# Altium project MI_04-08_MCU.PrjPcb
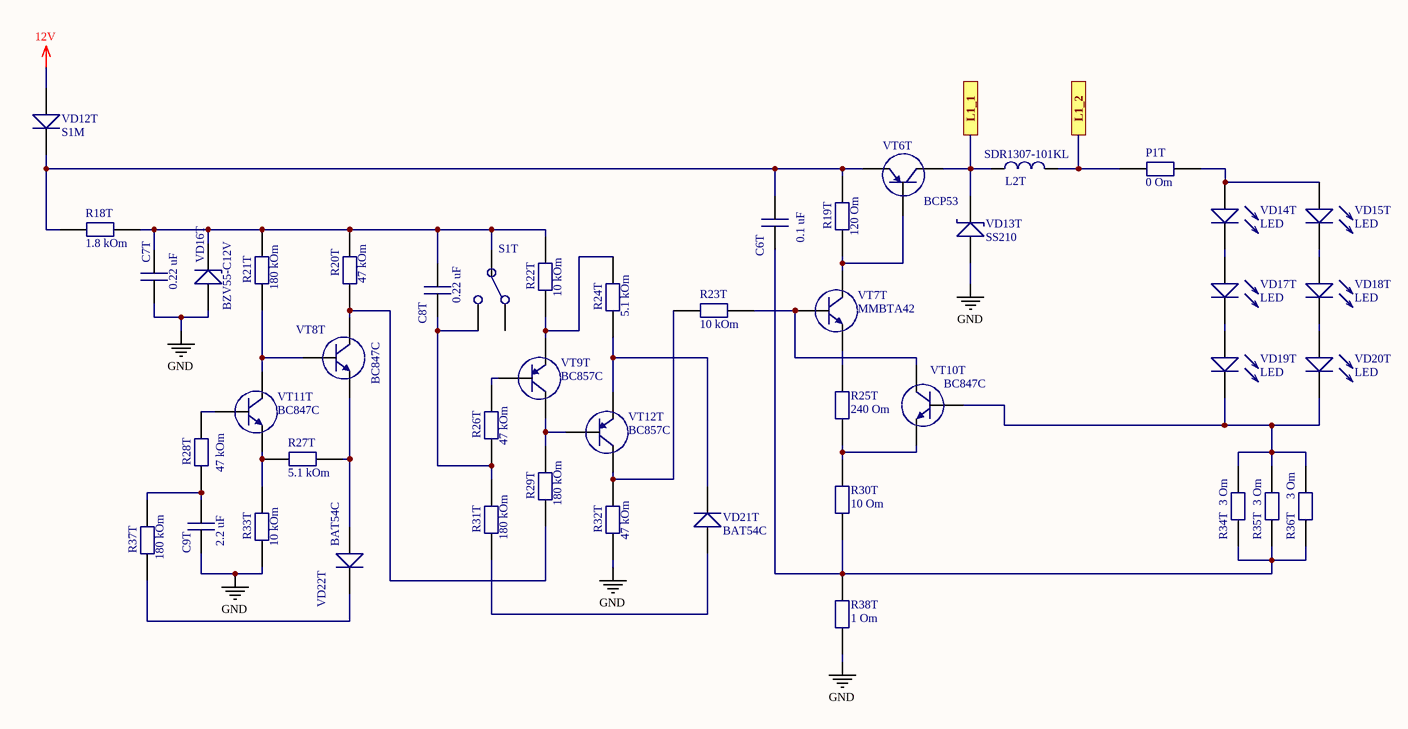
[diagram p0: MI_04_05.SchDoc]
Revision: Rev_4.1
2 sheets, 94 parts. Net scope: flat (ports and power ports of the same name join across sheets).
Board file: MI_04-08_MCU.PcbDoc
Sheets:
  MI_04_05.SchDoc
  MI_06_07_08_MCU.SchDoc

## Sheet MI_04_05.SchDoc
size 410 x 297 mm; Author: Красноперов

### Parts
C6T  value 0.1 uF  [CAP1206]  (hidden comment: Capacitor)
C7T  value 0.22 uF  [CAP1206]  (hidden comment: Capacitor)
C8T  value 0.22 uF  [CAP1206]  (hidden comment: Capacitor)
C9T  value 2.2 uF  [CAP1206]  (hidden comment: Capacitor)
L2T  value SDR1307-101KL  [SDR1307]  (hidden comment: coil)
P1T  value 0 Om  [RES1206]  (hidden comment: Resistor)
R18T  value 1.8 kOm  [RES1206]  (hidden comment: Resistor)
R19T  value 120 Om  [RES1206]  (hidden comment: Resistor)
R20T  value 47 kOm  [RES1206]  (hidden comment: Resistor)
R21T  value 180 kOm  [RES1206]  (hidden comment: Resistor)
R22T  value 10 kOm  [RES1206]  (hidden comment: Resistor)
R23T  value 10 kOm  [RES1206]  (hidden comment: Resistor)
R24T  value 5.1 kOm  [RES1206]  (hidden comment: Resistor)
R25T  value 240 Om  [RES1206]  (hidden comment: Resistor)
R26T  value 47 kOm  [RES1206]  (hidden comment: Resistor)
R27T  value 5.1 kOm  [RES1206]  (hidden comment: Resistor)
R28T  value 47 kOm  [RES1206]  (hidden comment: Resistor)
R29T  value 180 kOm  [RES1206]  (hidden comment: Resistor)
R30T  value 10 Om  [RES1206]  (hidden comment: Resistor)
R31T  value 180 kOm  [RES1206]  (hidden comment: Resistor)
R32T  value 47 kOm  [RES1206]  (hidden comment: Resistor)
R33T  value 10 kOm  [RES1206]  (hidden comment: Resistor)
R34T  value 3 Om  [RES1206]  (hidden comment: Resistor)
R35T  value 3 Om  [RES1206]  (hidden comment: Resistor)
R36T  value 3 Om  [RES1206]  (hidden comment: Resistor)
R37T  value 180 kOm  [RES1206]  (hidden comment: Resistor)
R38T  value 1 Om  [RES1206]  (hidden comment: Resistor)
S1T  (no value)  [Solder_connector]
VD12T  value S1M  [SMA-F]  (hidden comment: Diode)
VD13T  value SS210  [SMB1]  (hidden comment: Schottky)
VD14T  LED  [LED_MAJAK]
VD15T  LED  [LED_MAJAK]
VD16T  value BZV55-C12V  [minimelf]  (hidden comment: Zenner)
VD17T  LED  [LED_MAJAK]
VD18T  LED  [LED_MAJAK]
VD19T  LED  [LED_MAJAK]
VD20T  LED  [LED_MAJAK]
VD21T  value BAT54C  [SOT 23]  (hidden comment: Diode)
VD22T  value BAT54C  [SOT 23]  (hidden comment: Diode)
VT6T  value BCP53  [SOT223]  (hidden comment: PNP)
VT7T  value MMBTA42  [SOT 23]  (hidden comment: NPN)
VT8T  value BC847C  [SOT 23]  (hidden comment: NPN)
VT9T  value BC857C  [SOT 23]  (hidden comment: PNP)
VT10T  value BC847C  [SOT 23]  (hidden comment: NPN)
VT11T  value BC847C  [SOT 23]  (hidden comment: NPN)
VT12T  value BC857C  [SOT 23]  (hidden comment: PNP)

### Ports
L1_1, L1_2

### Nets
4V: L2T.1 VD13T.1 VT6T.K ; port L1_1
12V: VD12T.2
GND: C7T.1 C9T.1 R32T.2 R33T.2 R38T.1 VD13T.2 VD16T.2
NetC6T_1: C6T.1 R30T.1 R34T.1 R35T.1 R36T.1 R38T.2
NetC6T_2: C6T.2 R18T.2 R19T.1 VD12T.1 VT6T.E
NetC7T_2: C7T.2 C8T.2 R18T.1 R20T.1 R21T.1 R22T.1 S1T.1 VD16T.1
NetC8T_1: C8T.1 R26T.2 R31T.1 S1T.2
NetC9T_2: C9T.2 R28T.2 R37T.1
NetL1B_1: L2T.2 P1T.1 ; port L1_2
NetP1T_2: P1T.2 VD14T.2 VD15T.2
NetR19T_2: R19T.2 VT6T.B VT7T.K
NetR20T_2: R20T.2 R29T.2 VT8T.K
NetR21T_2: R21T.2 VT8T.B VT11T.K
NetR22T_2: R22T.2 R24T.1 VT9T.E
NetR23T_1: R23T.1 R32T.1 VT12T.K
NetR23T_2: R23T.2 VT7T.B VT10T.K
NetR24T_2: R24T.2 VD21T.1 VT12T.E
NetR25T_1: R25T.1 R30T.2 VT10T.E
NetR25T_2: R25T.2 VT7T.E
NetR26T_1: R26T.1 VT9T.B
NetR27T_1: R27T.1 VD22T.2 VT8T.E
NetR27T_2: R27T.2 R33T.1 VT11T.E
NetR28T_1: R28T.1 VT11T.B
NetR29T_1: R29T.1 VT9T.K VT12T.B
NetR31T_2: R31T.2 VD21T.2
NetR34T_2: R34T.2 R35T.2 R36T.2 VD19T.1 VD20T.1 VT10T.B
NetR37T_2: R37T.2 VD22T.1
NetVD14T_1: VD14T.1 VD17T.2
NetVD15T_1: VD15T.1 VD18T.2
NetVD17T_1: VD17T.1 VD19T.2
NetVD18T_1: VD18T.1 VD20T.2

Not connected (* = marked no-connect by the designer): S1T 3

### Notes on the sheet
- Перв. примен.
- Справ. №
- Подп. и дата
- Инв. № дубл.
- Взам. инв. №
- Разраб.
- Изм.
- Лист
- № докум.
- Подп.
- Дата
- Литера
- Масса
- Масштаб
- Пров.
- Т.контр.
- Листов
- Инв. № подл.
- Н.контр.
- Утв.
- Форма 1 ГОСТ 2.104-2006
- Копировал
- Формат А3

### Library data of the parts
S1T = switch: pin to pad: 3>2; Value: switch
VD21T VD22T = Diode: pin to pad: 1>3 2>1+2
VT6T = PNP: pin to pad: B>1 E>3 K>2
VT7T VT8T VT10T VT11T = NPN: pin to pad: B>1 E>2 K>3
VT9T VT12T = PNP: pin to pad: B>1 E>2 K>3
VD14T VD15T VD17T VD18T VD19T VD20T = LED: Value: LED

## Sheet MI_06_07_08_MCU.SchDoc
size 209 x 297 mm
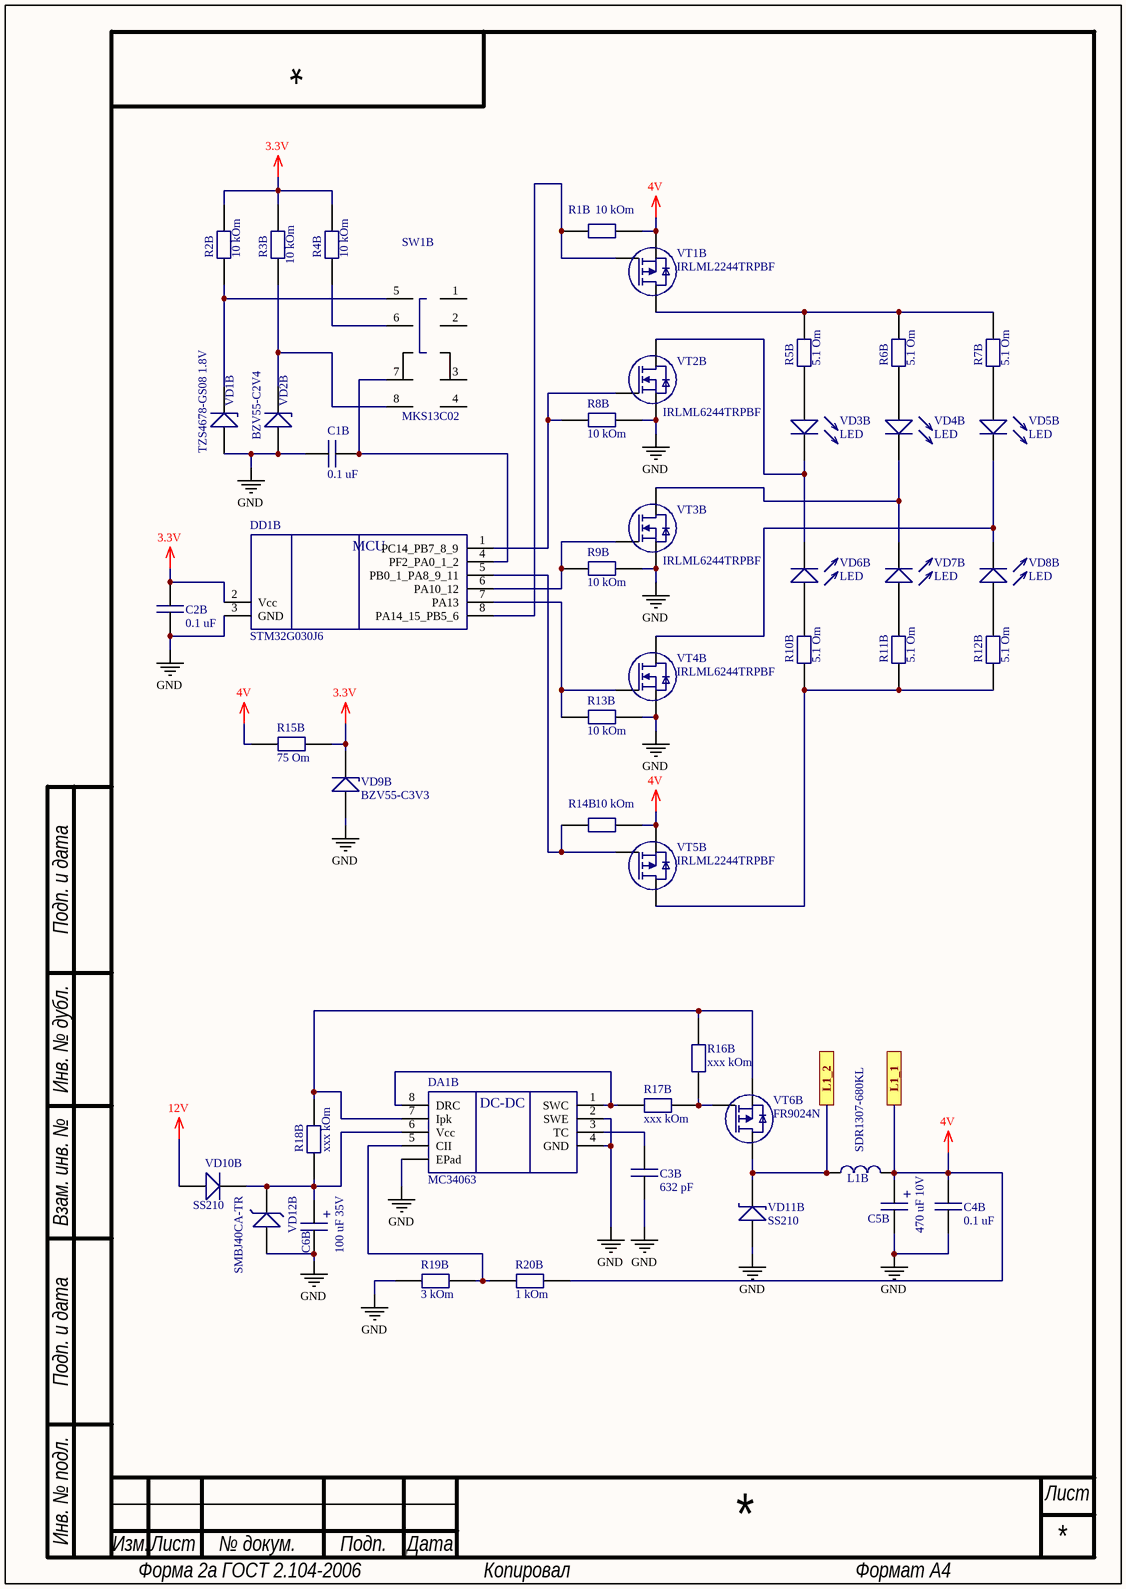
[diagram p1: MI_06_07_08_MCU.SchDoc]

### Parts
C1B  value 0.1 uF  [CAP1206]  (hidden comment: Capacitor)
C2B  value 0.1 uF  [CAP1206]  (hidden comment: Capacitor)
C3B  value 632 pF  [CAP1206]  (hidden comment: Capacitor)
C4B  value 0.1 uF  [CAP1206]  (hidden comment: Capacitor)
C5B  value 470 uF 10V  [CAP6.3x7.7]  (hidden comment: Capacitor_Polar)
C6B  value 100 uF 35V  [CAP6.3x7.7]  (hidden comment: Capacitor_Polar)
DA1B  MC34063  [SOIC-8-EPad]
DD1B  STM32G030J6  [SOIC-8]
L1B  value SDR1307-680KL  [SDR1307]  (hidden comment: coil)
R1B  value 10 kOm  [RES1206]  (hidden comment: Resistor)
R2B  value 10 kOm  [RES1206]  (hidden comment: Resistor)
R3B  value 10 kOm  [RES1206]  (hidden comment: Resistor)
R4B  value 10 kOm  [RES1206]  (hidden comment: Resistor)
R5B  value 5.1 Om  [RES1206]  (hidden comment: Resistor)
R6B  value 5.1 Om  [RES1206]  (hidden comment: Resistor)
R7B  value 5.1 Om  [RES1206]  (hidden comment: Resistor)
R8B  value 10 kOm  [RES1206]  (hidden comment: Resistor)
R9B  value 10 kOm  [RES1206]  (hidden comment: Resistor)
R10B  value 5.1 Om  [RES1206]  (hidden comment: Resistor)
R11B  value 5.1 Om  [RES1206]  (hidden comment: Resistor)
R12B  value 5.1 Om  [RES1206]  (hidden comment: Resistor)
R13B  value 10 kOm  [RES1206]  (hidden comment: Resistor)
R14B  value 10 kOm  [RES1206]  (hidden comment: Resistor)
R15B  value 75 Om  [RES1206]  (hidden comment: Resistor)
R16B  value xxx kOm  [RES1206]  (hidden comment: Resistor)
R17B  value xxx kOm  [RES1206]  (hidden comment: Resistor)
R18B  value xxx kOm  [RES1206]  (hidden comment: Resistor)
R19B  value 3 kOm  [RES1206]  (hidden comment: Resistor)
R20B  value 1 kOm  [RES1206]  (hidden comment: Resistor)
SW1B  value MKS13C02  [K3-2346S-K1]  (hidden comment: K3-2346S-K1)
VD1B  value TZS4678-GS08 1.8V  [minimelf]  (hidden comment: Zenner)
VD2B  value BZV55-C2V4  [minimelf]  (hidden comment: Zenner)
VD3B  LED  [LED_MAJAK2]
VD4B  LED  [LED_MAJAK2]
VD5B  LED  [LED_MAJAK2]
VD6B  LED  [LED_MAJAK2]
VD7B  LED  [LED_MAJAK2]
VD8B  LED  [LED_MAJAK2]
VD9B  value BZV55-C3V3  [minimelf]  (hidden comment: Zenner)
VD10B  value SS210  [SMB1]  (hidden comment: Diode)
VD11B  value SS210  [SMB1]  (hidden comment: Schottky)
VD12B  value SMBJ40CA-TR  [SMB1]  (hidden comment: Suppressor)
VT1B  value IRLML2244TRPBF  [SOT 23]  (hidden comment: MOSFET-P)
VT2B  value IRLML6244TRPBF  [SOT 23]  (hidden comment: MOSFET-N)
VT3B  value IRLML6244TRPBF  [SOT 23]  (hidden comment: MOSFET-N)
VT4B  value IRLML6244TRPBF  [SOT 23]  (hidden comment: MOSFET-N)
VT5B  value IRLML2244TRPBF  [SOT 23]  (hidden comment: MOSFET-P)
VT6B  value FR9024N  [D PAK]  (hidden comment: MOSFET-P)

### Ports
L1_1, L1_2

### Nets
3.3V: C2B.2 DD1B.2(Vcc) R2B.1 R3B.1 R4B.1 R15B.1 VD9B.1
4V: C4B.1 C5B.1 L1B.2 R1B.2 R14B.2 R15B.2 R20B.2 VT1B.S VT5B.S ; port L1_1
12V: VD10B.1
GND: C1B.2 C2B.1 C3B.2 C4B.2 C5B.2 C6B.2 DA1B.0(EPad) DA1B.2(SWE) DA1B.4(GND) DD1B.3(GND) R8B.2 R9B.2 R13B.2 R19B.2 VD1B.1 VD2B.1 VD9B.2 VD11B.2 VD12B.2 VT2B.S VT3B.S VT4B.S
NetC1B_1: C1B.1 DD1B.4(PF2_PA0_1_2) SW1B.7
NetC3B_1: C3B.1 DA1B.3(TC)
NetC6B_1: C6B.1 DA1B.6(Vcc) R18B.2 VD10B.3 VD12B.1
NetDA1B_1: DA1B.1(SWC) DA1B.8(DRC) R17B.2
NetDA1B_5: DA1B.5(CII) R19B.1 R20B.1
NetDA1B_7: DA1B.7(Ipk) R16B.1 R18B.1 VT6B.S
NetDD1B_1: DD1B.1(PC14_PB7_8_9) R8B.1 VT2B.G
NetDD1B_5: DD1B.5(PB0_1_PA8_9_11) R14B.1 VT5B.G
NetDD1B_6: DD1B.6(PA10_12) R9B.1 VT3B.G
NetDD1B_7: DD1B.7(PA13) R13B.1 VT4B.G
NetDD1B_8: DD1B.8(PA14_15_PB5_6) R1B.1 VT1B.G
NetL1B_1: L1B.1 VD11B.1 VT6B.D ; port L1_2
NetR2B_2: R2B.2 SW1B.5 VD1B.3
NetR3B_2: R3B.2 SW1B.8 VD2B.3
NetR4B_2: R4B.2 SW1B.6
NetR5B_1: R5B.1 R6B.1 R7B.1 VT1B.D
NetR5B_2: R5B.2 VD3B.2
NetR6B_2: R6B.2 VD4B.2
NetR7B_2: R7B.2 VD5B.2
NetR10B_1: R10B.1 VD6B.2
NetR10B_2: R10B.2 R11B.2 R12B.2 VT5B.D
NetR11B_1: R11B.1 VD7B.2
NetR12B_1: R12B.1 VD8B.2
NetR16B_2: R16B.2 R17B.1 VT6B.G
NetVD3B_1: VD3B.1 VD6B.1 VT2B.D
NetVD4B_1: VD4B.1 VD7B.1 VT3B.D
NetVD5B_1: VD5B.1 VD8B.1 VT4B.D

Not connected (* = marked no-connect by the designer): SW1B 1 2 3 4

### Notes on the sheet
- Подп. и дата
- Инв. № дубл.
- Взам. инв. №
- Инв. № подл.
- Изм.
- Лист
- № докум.
- Подп.
- Дата
- Форма 2а ГОСТ 2.104-2006
- Копировал
- Формат А4
- (in symbol Capacitor_Polar) +
- (in symbol MC34063) DC-DC
- (in symbol STM32G030J6) MCU

### Library data of the parts
VD1B VD2B = Zenner: pin to pad: 3>2
VD10B = Diode: pin to pad: 3>2
VT1B VT5B = MOSFET-P: pin to pad: D>3 G>1 S>2
VT2B VT3B VT4B = MOSFET-N: pin to pad: D>3 G>1 S>2
VT6B = MOSFET-P: pin to pad: D>2 G>1 S>3
DA1B = MC34063: Value: MC34063
DD1B = STM32G030J6: Value: STM32G030J6
VD3B VD4B VD5B VD6B VD7B VD8B = LED: Value: LED

## Nets that join several sheets
4V: MI_04_05 (L2T.1 VD13T.1 VT6T.K), MI_06_07_08_MCU (9 pins)
12V: MI_04_05 (VD12T.2), MI_06_07_08_MCU (VD10B.1)
GND: MI_04_05 (7 pins), MI_06_07_08_MCU (22 pins)
NetL1B_1: MI_04_05 (L2T.2 P1T.1), MI_06_07_08_MCU (L1B.1 VD11B.1 VT6B.D)

## Assembly variants
Variant of MI_04-08_MCU: all parts fitted